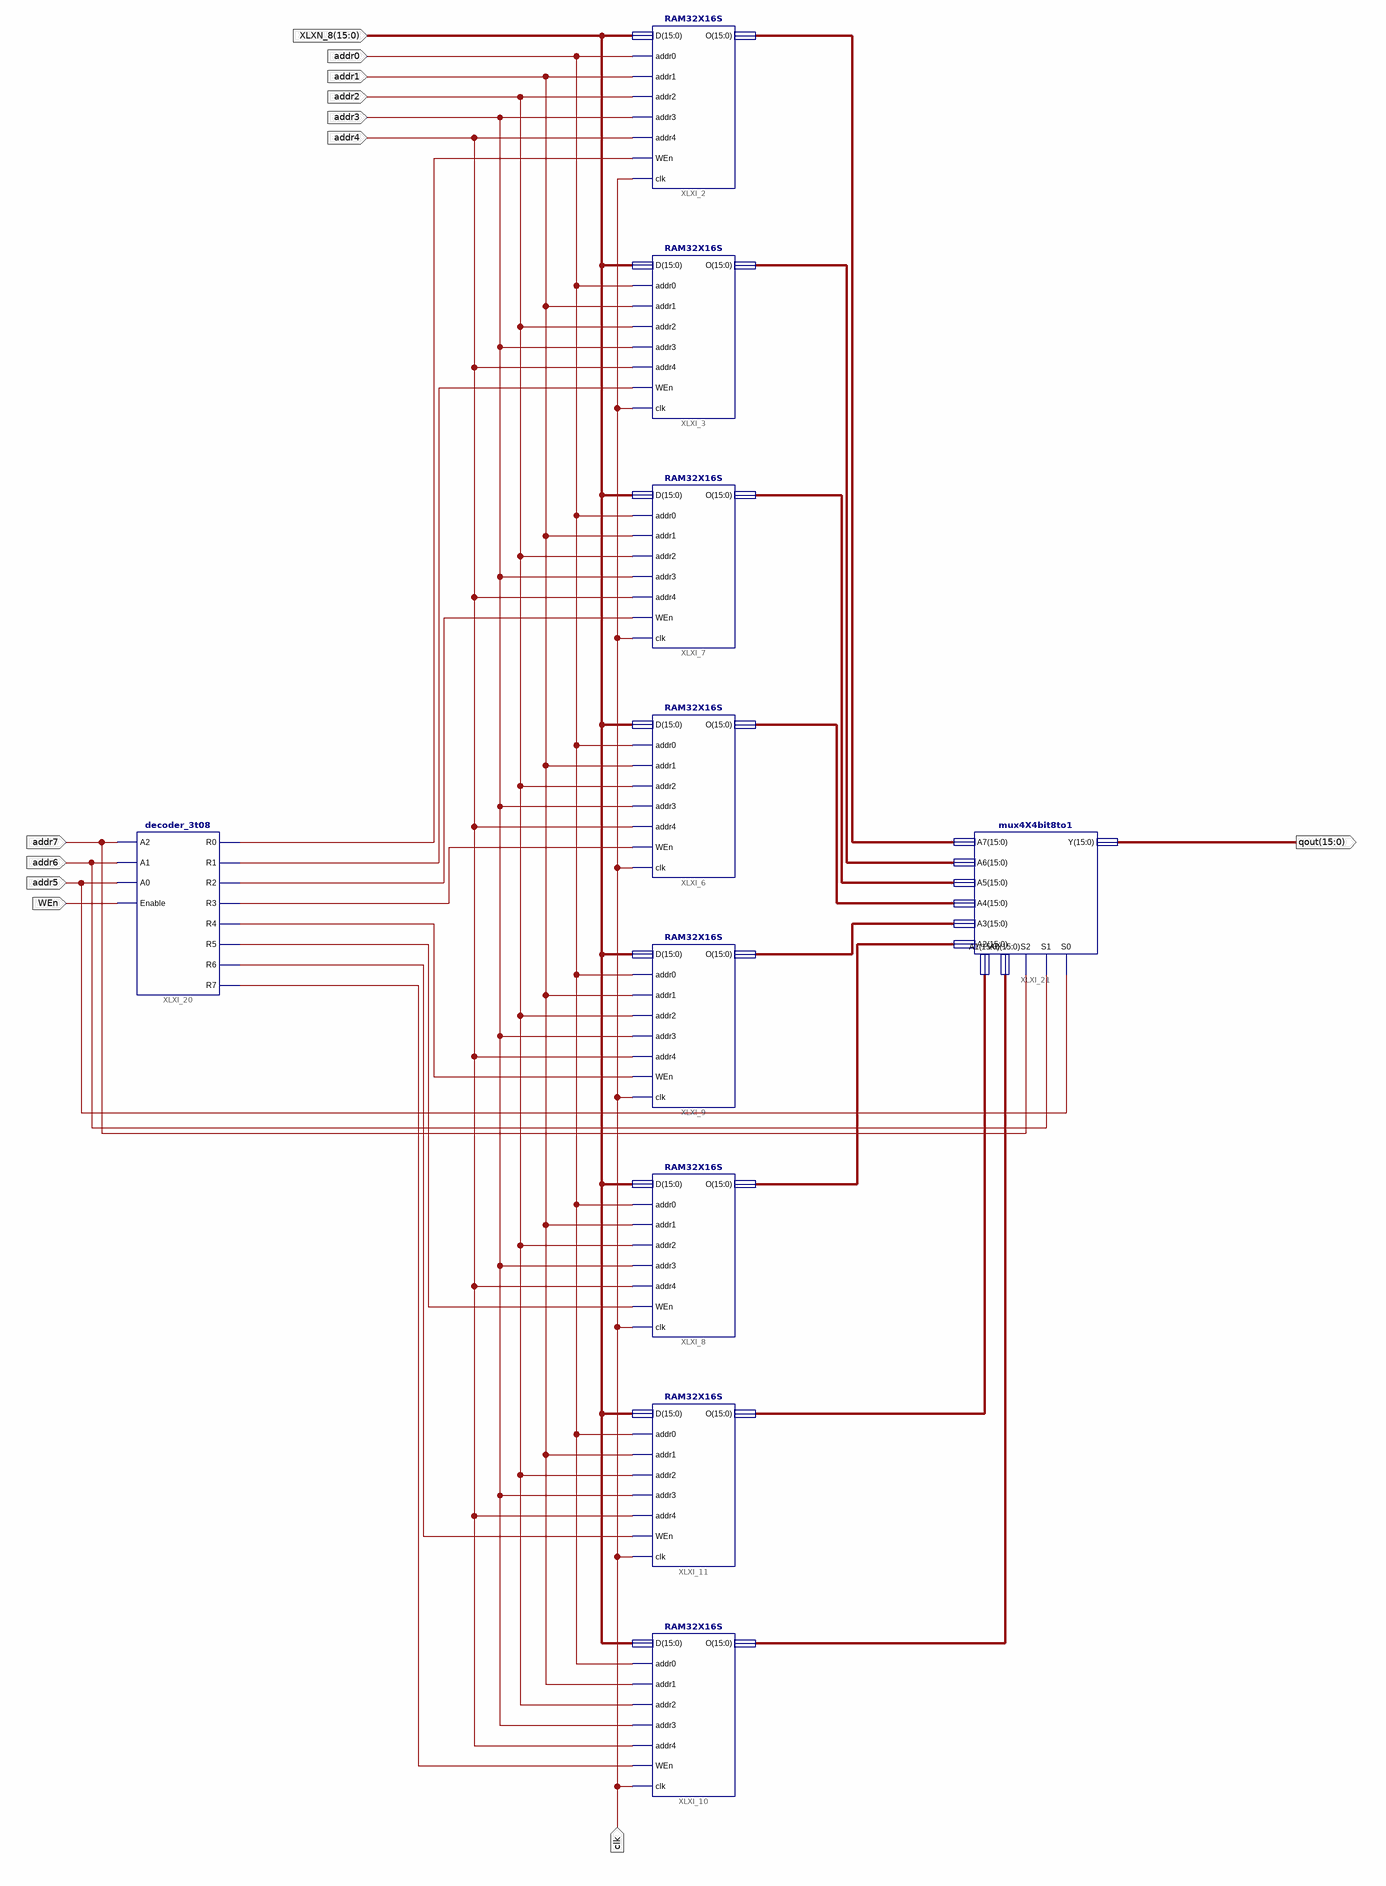
[diagram p0: schematic sheet 1]
// Xilinx ISE schematic Memory_Module256x16.sch (spartan3e) as structural Verilog: 10 symbols, 12 ports
module Memory_Module256x16 (
  input  [15:0] XLXN_8,
  input  addr0,
  input  addr1,
  input  addr2,
  input  addr3,
  input  addr4,
  input  clk,
  input  addr7,
  input  addr6,
  input  addr5,
  input  WEn,
  output [15:0] qout
);

  wire XLXN_50, XLXN_51, XLXN_52, XLXN_53, XLXN_54, XLXN_55, XLXN_56, XLXN_57;
  wire [15:0] XLXN_70, XLXN_71, XLXN_72, XLXN_73, XLXN_74, XLXN_75, XLXN_76, XLXN_77;

  RAM32X16S XLXI_2 (
    .addr0(addr0), .addr1(addr1), .addr2(addr2), .addr3(addr3), .addr4(addr4), .clk(clk), .D(XLXN_8),
    .O(XLXN_70), .WEn(XLXN_50));
  RAM32X16S XLXI_3 (
    .addr0(addr0), .addr1(addr1), .addr2(addr2), .addr3(addr3), .addr4(addr4), .clk(clk), .D(XLXN_8),
    .O(XLXN_71), .WEn(XLXN_51));
  RAM32X16S XLXI_6 (
    .addr0(addr0), .addr1(addr1), .addr2(addr2), .addr3(addr3), .addr4(addr4), .clk(clk), .D(XLXN_8),
    .O(XLXN_73), .WEn(XLXN_53));
  RAM32X16S XLXI_7 (
    .addr0(addr0), .addr1(addr1), .addr2(addr2), .addr3(addr3), .addr4(addr4), .clk(clk), .D(XLXN_8),
    .O(XLXN_72), .WEn(XLXN_52));
  RAM32X16S XLXI_8 (
    .addr0(addr0), .addr1(addr1), .addr2(addr2), .addr3(addr3), .addr4(addr4), .clk(clk), .D(XLXN_8),
    .O(XLXN_75), .WEn(XLXN_55));
  RAM32X16S XLXI_9 (
    .addr0(addr0), .addr1(addr1), .addr2(addr2), .addr3(addr3), .addr4(addr4), .clk(clk), .D(XLXN_8),
    .O(XLXN_74), .WEn(XLXN_54));
  RAM32X16S XLXI_10 (
    .addr0(addr0), .addr1(addr1), .addr2(addr2), .addr3(addr3), .addr4(addr4), .clk(clk), .D(XLXN_8),
    .O(XLXN_77), .WEn(XLXN_57));
  RAM32X16S XLXI_11 (
    .addr0(addr0), .addr1(addr1), .addr2(addr2), .addr3(addr3), .addr4(addr4), .clk(clk), .D(XLXN_8),
    .O(XLXN_76), .WEn(XLXN_56));
  decoder_3t08 XLXI_20 (
    .A0(addr5), .A1(addr6), .A2(addr7), .Enable(WEn), .R0(XLXN_50), .R1(XLXN_51), .R2(XLXN_52), .R3(XLXN_53),
    .R4(XLXN_54), .R5(XLXN_55), .R6(XLXN_56), .R7(XLXN_57));
  mux4X4bit8to1 XLXI_21 (
    .A7(XLXN_70), .A6(XLXN_71), .A5(XLXN_72), .A4(XLXN_73), .A3(XLXN_74), .A2(XLXN_75), .Y(qout),
    .A1(XLXN_76), .S2(addr7), .S1(addr6), .S0(addr5), .A0(XLXN_77));
endmodule
